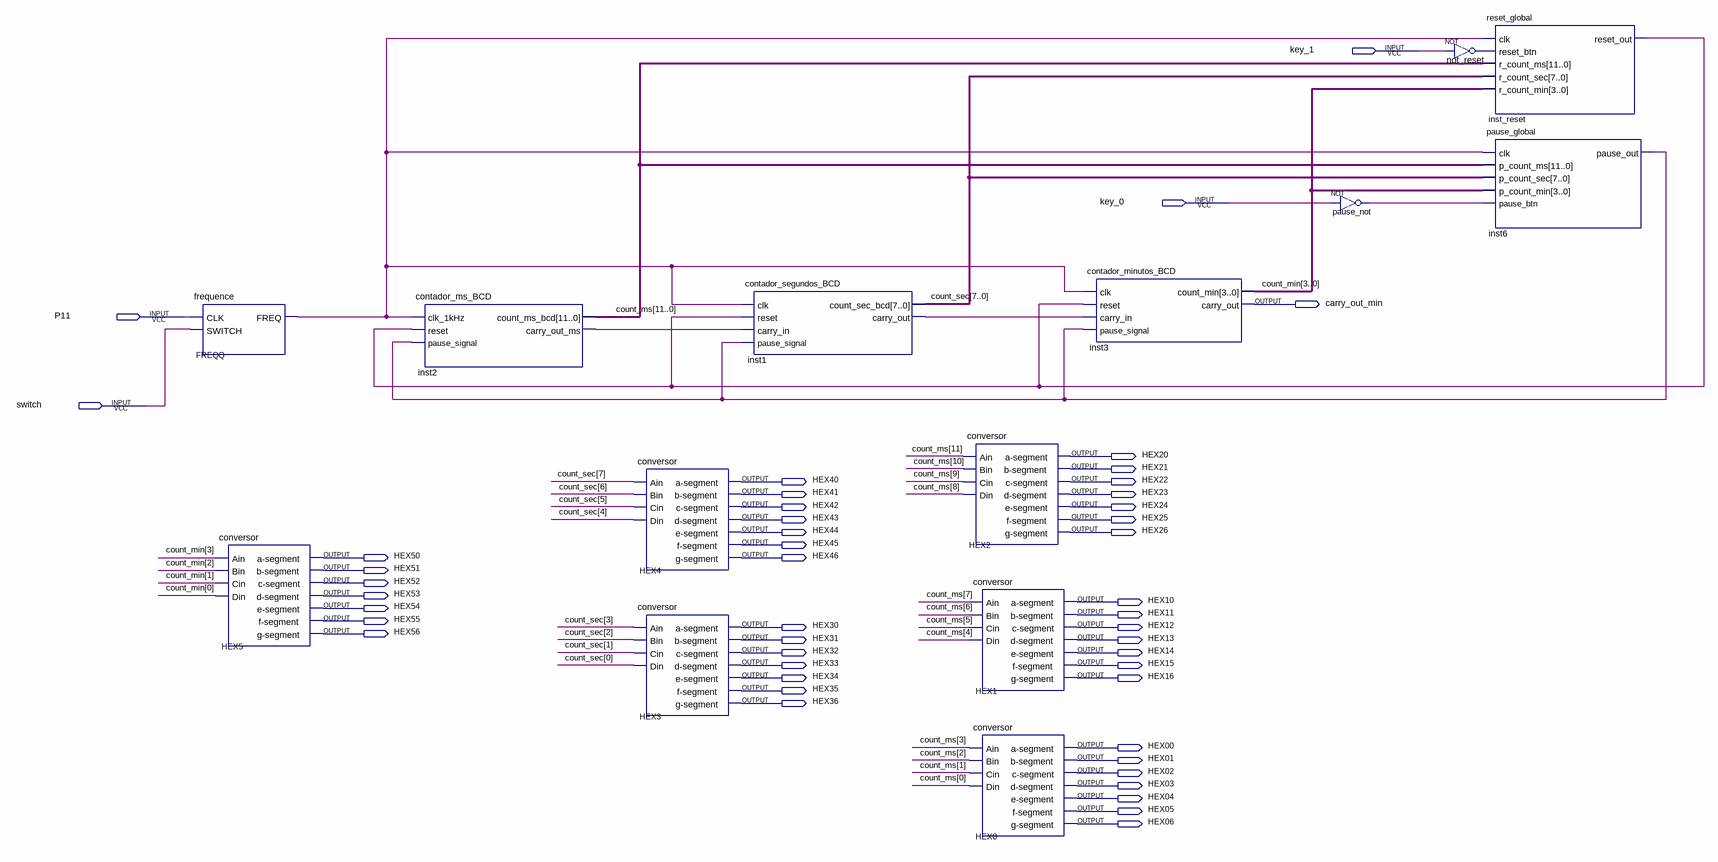
[diagram p0: schematic sheet]
// Quartus schematic CRONOMETRO.bdf as structural Verilog: 14 symbols, 47 pins
module CRONOMETRO (
  input  key_1,
  input  key_0,
  input  P11,
  input  switch,
  output carry_out_min,
  output HEX20,
  output HEX21,
  output HEX40,
  output HEX22,
  output HEX41,
  output HEX23,
  output HEX42,
  output HEX24,
  output HEX43,
  output HEX25,
  output HEX44,
  output HEX26,
  output HEX45,
  output HEX50,
  output HEX46,
  output HEX51,
  output HEX52,
  output HEX53,
  output HEX10,
  output HEX54,
  output HEX11,
  output HEX55,
  output HEX30,
  output HEX12,
  output HEX56,
  output HEX31,
  output HEX13,
  output HEX32,
  output HEX14,
  output HEX33,
  output HEX15,
  output HEX34,
  output HEX16,
  output HEX35,
  output HEX36,
  output HEX00,
  output HEX01,
  output HEX02,
  output HEX03,
  output HEX04,
  output HEX05,
  output HEX06
);

  wire FREQQ_freq, inst1_carry_out, inst2_carry_out_ms, inst6_pause_out, inst_reset_reset_out, not_reset_out,
       pause_not_out;
  wire [3:0] count_min;
  wire [7:0] count_sec;
  wire [11:0] count_ms;

  frequence FREQQ (.CLK(P11), .SWITCH(switch), .FREQ(FREQQ_freq));
  conversor HEX5 (
    .Ain(count_min[3]), .Bin(count_min[2]), .Cin(count_min[1]), .Din(count_min[0]), .\a-segment (HEX50),
    .\b-segment (HEX51), .\c-segment (HEX52), .\d-segment (HEX53), .\e-segment (HEX54), .\f-segment (HEX55),
    .\g-segment (HEX56));
  contador_ms_BCD inst2 (
    .clk_1kHz(FREQQ_freq), .reset(inst_reset_reset_out), .pause_signal(inst6_pause_out),
    .count_ms_bcd(count_ms), .carry_out_ms(inst2_carry_out_ms));
  conversor HEX4 (
    .Ain(count_sec[7]), .Bin(count_sec[6]), .Cin(count_sec[5]), .Din(count_sec[4]), .\a-segment (HEX40),
    .\b-segment (HEX41), .\c-segment (HEX42), .\d-segment (HEX43), .\e-segment (HEX44), .\f-segment (HEX45),
    .\g-segment (HEX46));
  conversor HEX3 (
    .Ain(count_sec[3]), .Bin(count_sec[2]), .Cin(count_sec[1]), .Din(count_sec[0]), .\a-segment (HEX30),
    .\b-segment (HEX31), .\c-segment (HEX32), .\d-segment (HEX33), .\e-segment (HEX34), .\f-segment (HEX35),
    .\g-segment (HEX36));
  contador_segundos_BCD inst1 (
    .clk(FREQQ_freq), .reset(inst_reset_reset_out), .carry_in(inst2_carry_out_ms),
    .pause_signal(inst6_pause_out), .count_sec_bcd(count_sec), .carry_out(inst1_carry_out));
  conversor HEX2 (
    .Ain(count_ms[11]), .Bin(count_ms[10]), .Cin(count_ms[9]), .Din(count_ms[8]), .\a-segment (HEX20),
    .\b-segment (HEX21), .\c-segment (HEX22), .\d-segment (HEX23), .\e-segment (HEX24), .\f-segment (HEX25),
    .\g-segment (HEX26));
  conversor HEX1 (
    .Ain(count_ms[7]), .Bin(count_ms[6]), .Cin(count_ms[5]), .Din(count_ms[4]), .\a-segment (HEX10),
    .\b-segment (HEX11), .\c-segment (HEX12), .\d-segment (HEX13), .\e-segment (HEX14), .\f-segment (HEX15),
    .\g-segment (HEX16));
  conversor HEX0 (
    .Ain(count_ms[3]), .Bin(count_ms[2]), .Cin(count_ms[1]), .Din(count_ms[0]), .\a-segment (HEX00),
    .\b-segment (HEX01), .\c-segment (HEX02), .\d-segment (HEX03), .\e-segment (HEX04), .\f-segment (HEX05),
    .\g-segment (HEX06));
  contador_minutos_BCD inst3 (
    .clk(FREQQ_freq), .reset(inst_reset_reset_out), .carry_in(inst1_carry_out),
    .pause_signal(inst6_pause_out), .count_min(count_min), .carry_out(carry_out_min));
  not pause_not (pause_not_out, key_0);
  reset_global inst_reset (
    .clk(FREQQ_freq), .reset_btn(not_reset_out), .r_count_ms(count_ms), .r_count_sec(count_sec),
    .r_count_min(count_min), .reset_out(inst_reset_reset_out));
  not not_reset (not_reset_out, key_1);
  pause_global inst6 (
    .clk(FREQQ_freq), .p_count_ms(count_ms), .p_count_sec(count_sec), .p_count_min(count_min),
    .pause_btn(pause_not_out), .pause_out(inst6_pause_out));
endmodule
